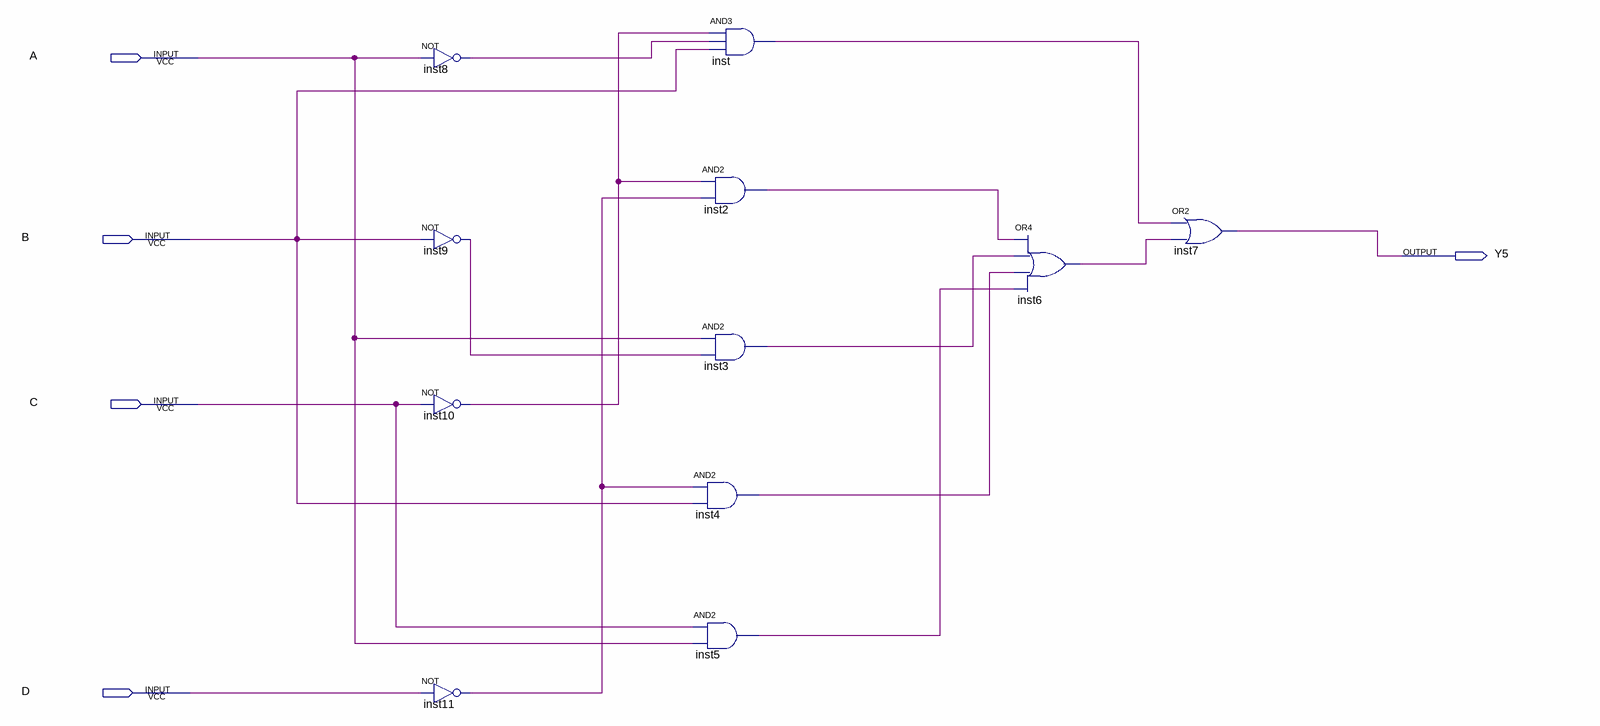
[diagram p0: schematic sheet]
// Quartus schematic five.bdf as structural Verilog: 11 symbols, 5 pins
module five (
  input  A,
  input  B,
  input  C,
  input  D,
  output Y5
);

  wire inst2_out, inst3_out, inst4_out, inst5_out, inst6_out, inst8_out, inst9_out, inst10_out, inst11_out,
       inst_out;

  not inst8 (inst8_out, A);
  not inst9 (inst9_out, B);
  not inst10 (inst10_out, C);
  not inst11 (inst11_out, D);
  and inst (inst_out, inst10_out, inst8_out, B);
  and inst2 (inst2_out, inst10_out, inst11_out);
  and inst3 (inst3_out, A, inst9_out);
  and inst4 (inst4_out, inst11_out, B);
  and inst5 (inst5_out, C, A);
  or inst6 (inst6_out, inst2_out, inst3_out, inst4_out, inst5_out);
  or inst7 (Y5, inst_out, inst6_out);
endmodule
